# Altium project hcpl316j_Driver.PrjPcb
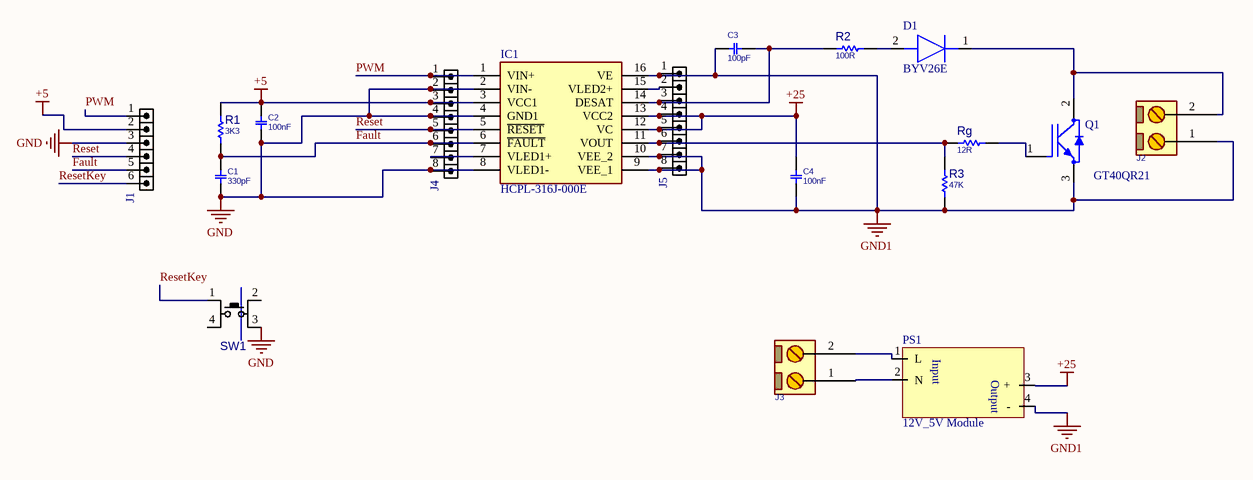
[diagram p0: Sheet1.SchDoc]
1 sheet, 18 parts. Net scope: global (net labels, ports and power ports of the same name join across sheets).
Board files: PCB1(bak_smd).PcbDoc, PCB1.PcbDoc, Print_PCB1.PcbDoc

## Sheet Sheet1.SchDoc
size A; SheetNumber: 1; SheetTotal: 1; SPICEModelCacheWEIBBDHN: <root> / <DocumentId>WEIBBDHN</DocumentId> / </root>

### Parts
C1  330pF  [C_CER_D3]
C2  100nF  [C_CER_D6B]
C3  100pF  [C_CER_D3]
C4  100nF  [C_CER_D6B]
D1  BYV26E  [DIOAD1411W86L465D236]
IC1  HCPL-316J-000E  [SOIC127P1016X391-16N]
J1  HDR1X6  [HDR_M_1X6]  (value not drawn)
J2  CONN_TB2  [TBG_2]  (value not drawn)
J3  CONN_TB2  [TBG_2]  (value not drawn)
J4  HDR1X8  [HDR_M_1X8]  (value not drawn)
J5  HDR1X8  [HDR_M_1X8]  (value not drawn)
PS1  12V_5V Module  [12V_5V Module]
Q1  GT40QR21  [TO247_3]
R1  3K3  [R025W_AX04]
R2  100R  [R025W_AX04]
R3  47K  [R025W_AX04]
Rg  12R  [R2W_AX08]
SW1  PUSHBUTTON  [SWPBT_SPDT_6X6X5]  (value not drawn)

### Nets
+5: C2.2 IC1.3(VCC1) J1.2 J4.3 R1.2
+25: C4.2 IC1.12(VC) IC1.13(VCC2) J5.4 J5.5 PS1.3(+)
GND: C1.2 C2.1 IC1.2(VIN-) IC1.4(GND1) IC1.8(VLED1-) J1.3 J4.2 J4.4 J4.8 SW1.3(P4)
GND1: C3.1 C4.1 IC1.9(VEE_1) IC1.10(VEE_2) IC1.16(VE) J2.1 J5.1 J5.7 J5.8 PS1.4(-) Q1.3(E) R3.1
Fault: C1.1 IC1.6(~{FAULT}) J1.5 J4.6 R1.1
PWM: IC1.1(VIN+) J1.1 J4.1
Reset: IC1.5(~{RESET}) J1.4 J4.5
ResetKey: J1.6 SW1.1(P1)
NetC3_2: C3.2 IC1.14(DESAT) J5.3 R2.1
NetD1_1: D1.1(K) J2.2 Q1.2(C)
NetD1_2: D1.2(A) R2.2
NetIC1_7: IC1.7(VLED1+) J4.7
NetIC1_11: IC1.11(VOUT) J5.6 R3.2 Rg.1
NetIC1_15: IC1.15(VLED2+) J5.2
NetJ3_1: J3.1 PS1.2(N)
NetJ3_2: J3.2 PS1.1(L)
NetQ1_1: Q1.1(G) Rg.2

Not connected (* = marked no-connect by the designer): SW1 2(P3) 4(P2)

### Notes on the sheet
- (in symbol 12V_5V Module) Input; Output

### Library data of the parts
C1-C4 = CAP_THD_CERML: CAP, THD, CER MULTI LAYER,; PARAM: 50V; DESC: CAP, CER MULTI LAYER,; MANF_P#: MANF_PART#; PRICE: 100= 1$; MANF: MANF; PARAM2: PARAM2; ASSEMBLY: ASSEMBLY
  C1: VALUE: 330pF
  C2 C4: VALUE: 100nF
  C3: VALUE: 100pF
D1 = BYV26E: Diode; Manufacturer_Name: EIC Semiconductor; Datasheet Link: https://www.arrow.com/en/products/byv26e/eic-semiconductor; Manufacturer_Part_Number: BYV26E; Arrow Part Number: BYV26E; Arrow Price/Stock: https://www.arrow.com/en/products/byv26e/eic-semiconductor
IC1 = HCPL-316J-000E: Integrated Circuit; Manufacturer_Name: Avago Technologies; Datasheet Link: https://datasheet.datasheetarchive.com/originals/distributors/Datasheets-DGA14/636585.pdf; Height: 3.911mm; Manufacturer_Part_Number: HCPL-316J-000E; Mouser Part Number: 630-HCPL-316J-000E; Mouser Price/Stock: https://www.mouser.co.uk/ProductDetail/Broadcom-Avago/HCPL-316J-000E?qs=s%252BgfxR24RQ7EFYdN51aacA%3D%3D
J1 = HDR_M_1X6: CONN, HEADER, Male, pitch: 2.54mm, 6POS; VALUE: HDRM6
J2 J3 = CONN_TB2: CONN, TERMINAL BLOCK, 5.08mm pitch; VALUE: CONN_TB2
J4 J5 = HDR_M_1X8: CONN, HEADER, Male, pitch: 2.54mm, 8POS; VALUE: HDRM8
PS1 = 12V_5V Module: 220V to 12V/15V Module
Q1 = IGBT: MF: ON Semiconductor; MP: FGH40N60SFDTU; Value: *; SnapEDA_Link: https://www.snapeda.com/parts/FGH40N60SFDTU/ON%20Semiconductor/view-part/405516/?ref=snap; Package: TO-247 Fairchild Semiconductor; Price: None; Availability: Unavailable
R1-R3 Rg = RES_THD: RESISTOR, THD; MANF_P#: RK73H1ETTP4701F; MANF: KOA SPEER; PARAM: 0.063W; DESC: DESCRIPTION; DIST#: MOUSER; PARAM2: 1%; ASSEMBLY: ASSEMBLY; PRICE: 100= 0.5$
  R1: VALUE: 3K3
  R2: VALUE: 100R
  R3: VALUE: 47K
  Rg: VALUE: 12R
SW1 = SWPBT_SPDT_6X6X5: SWITCH, PUSH BUTTON, TACTILE, THD, SPDT, 4X4MM; DESC: DESCRIPTION; MANF: -; VALUE: PUSHBUTTON; ASSEMBLY: ASSEMBLY; PARAM: PARAM; PRICE: PRICE; MANF_P#: -